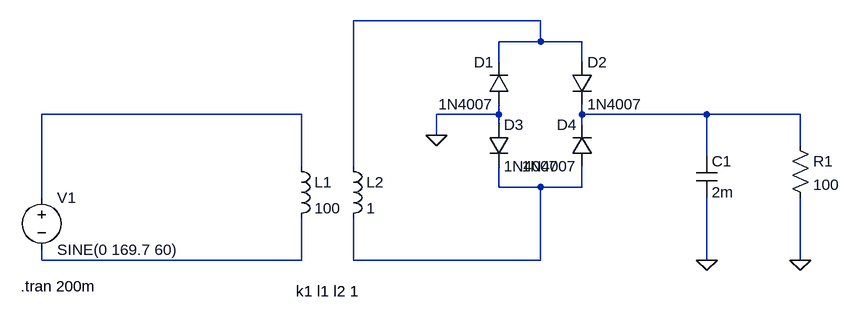
[diagram p0: schematic Rectificador.asc]
Rectificador.asc, the LTspice schematic file:
Version 4.1
SHEET 1 1252 680
WIRE 784 -128 496 -128
WIRE 784 -96 784 -128
WIRE 784 -96 720 -96
WIRE 848 -96 784 -96
WIRE 720 -64 720 -96
WIRE 848 -64 848 -96
WIRE 416 16 16 16
WIRE 720 16 720 0
WIRE 720 16 624 16
WIRE 848 16 848 0
WIRE 1040 16 848 16
WIRE 1184 16 1040 16
WIRE 720 32 720 16
WIRE 848 32 848 16
WIRE 624 48 624 16
WIRE 1184 64 1184 16
WIRE 1040 80 1040 16
WIRE 416 96 416 16
WIRE 496 96 496 -128
WIRE 720 128 720 96
WIRE 784 128 720 128
WIRE 848 128 848 96
WIRE 848 128 784 128
WIRE 16 144 16 16
WIRE 16 240 16 224
WIRE 416 240 416 176
WIRE 416 240 16 240
WIRE 496 240 496 176
WIRE 784 240 784 128
WIRE 784 240 496 240
WIRE 1040 240 1040 144
WIRE 1184 240 1184 144
FLAG 624 48 0
FLAG 1040 240 0
FLAG 1184 240 0
SYMBOL voltage 16 128 R0
WINDOW 123 0 0 Left 0
WINDOW 39 0 0 Left 0
SYMATTR InstName V1
SYMATTR Value SINE(0 169.7 60)
SYMBOL ind 400 80 R0
SYMATTR InstName L1
SYMATTR Value 100
SYMATTR Type ind
SYMATTR SpiceLine Rser=1m
SYMBOL ind 480 80 R0
SYMATTR InstName L2
SYMATTR Value 1
SYMATTR Type ind
SYMATTR SpiceLine Rser=1m
SYMBOL diode 736 0 R180
WINDOW 0 24 64 Left 2
WINDOW 3 24 0 Left 2
SYMATTR InstName D1
SYMATTR Value 1N4007
SYMBOL diode 832 -64 R0
SYMATTR InstName D2
SYMATTR Value 1N4007
SYMBOL diode 704 32 R0
SYMATTR InstName D3
SYMATTR Value 1N4007
SYMBOL diode 864 96 R180
WINDOW 0 24 64 Left 2
WINDOW 3 24 0 Left 2
SYMATTR InstName D4
SYMATTR Value 1N4007
SYMBOL res 1168 48 R0
SYMATTR InstName R1
SYMATTR Value 100
SYMBOL cap 1024 80 R0
SYMATTR InstName C1
SYMATTR Value 2m
TEXT -16 280 Left 2 !.tran 200m
TEXT 408 288 Left 2 !k1 l1 l2 1

The netlist it stands for:
* Rectificador.asc
V1 N002 N005 SINE(0 169.7 60)
L1 N002 N005 100 Rser=1m
L2 N001 N004 1 Rser=1m
D1 0 N001 1N4007
D2 N001 N003 1N4007
D3 0 N004 1N4007
D4 N004 N003 1N4007
R1 N003 0 100
C1 N003 0 2m
.model D D
.lib standard.dio
.tran 200m
k1 l1 l2 1
.backanno
.end